# Altium schematic sheet PlacaTestingNov.SchDoc
size A4
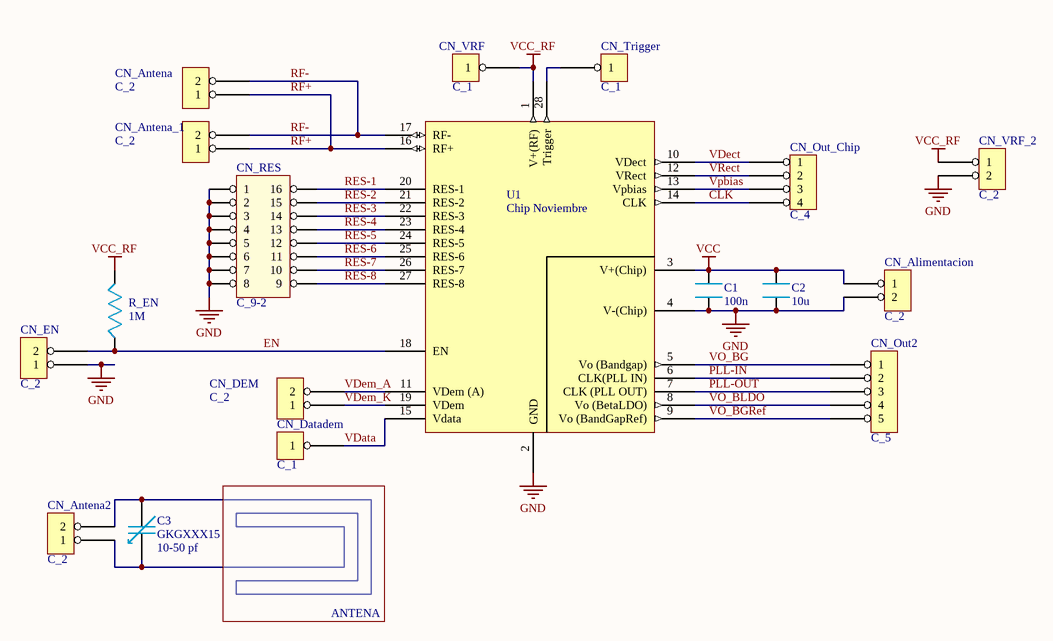
[diagram p0: PlacaTestingNov.SchDoc]

## Parts
C1  100n  [2x1 Pin Array]
C2  10u  [GKGXXX15]
C3  GKGXXX15  C: 10-50 pf  [GKGXXX15]
CN_Alimentacion  C_2  [2x1 Bornera]
CN_Antena  C_2  [2x1 Pin Array]
CN_Antena2  C_2  [2x1 Pin Array]
CN_Antena_1  C_2  [2x1 Bornera]
CN_Datadem  C_1  [1x1 Pin Array]
CN_DEM  C_2  [2x1 Pin Array]
CN_EN  C_2  [2x1 Pin Array]
CN_Out2  C_5  [5x1 Pin Array]
CN_Out_Chip  C_4  [4x1 Pin Array]
CN_RES  C_9-2  [PDIP_8]
CN_Trigger  C_1  [1x1 Pin Array]
CN_VRF  C_1  [1x1 Pin Array]
CN_VRF_2  C_2  [2x1 Bornera]
R_EN  1M  [R_1/4]
U1  Chip Noviembre  [PDIP_28 - Large]

## Nets
GND: C1.2 C2.2 CN_Alimentacion.2 CN_EN.1 CN_RES.1 CN_RES.2 CN_RES.3 CN_RES.4 CN_RES.5 CN_RES.6 CN_RES.7 CN_RES.8 CN_VRF_2.2 U1.2(GND) U1.4(V-(Chip))
VCC: C1.1 C2.1 CN_Alimentacion.1 U1.3(V+(Chip))
VCC_RF: CN_VRF.1 CN_VRF_2.1 R_EN.2 U1.1(V+(RF))
CLK: CN_Out_Chip.4 U1.14(CLK)
EN: CN_EN.2 R_EN.1 U1.18(EN)
PLL-IN: CN_Out2.2 U1.6(CLK(PLL_IN))
PLL-OUT: CN_Out2.3 U1.7(CLK_(PLL_OUT))
RES-1: CN_RES.16 U1.20(RES-1)
RES-2: CN_RES.15 U1.21(RES-2)
RES-3: CN_RES.14 U1.22(RES-3)
RES-4: CN_RES.13 U1.23(RES-4)
RES-5: CN_RES.12 U1.24(RES-5)
RES-6: CN_RES.11 U1.25(RES-6)
RES-7: CN_RES.10 U1.26(RES-7)
RES-8: CN_RES.9 U1.27(RES-8)
RF+: CN_Antena.1 CN_Antena_1.1 U1.16(RF+)
RF-: CN_Antena.2 CN_Antena_1.2 U1.17(RF-)
VData: CN_Datadem.1 U1.15(Vdata)
VDect: CN_Out_Chip.1 U1.10(VDect)
VDem_A: CN_DEM.2 U1.11(VDem_(A))
VDem_K: CN_DEM.1 U1.19(VDem)
VO_BG: CN_Out2.1 U1.5(Vo_(Bandgap))
VO_BGRef: CN_Out2.5 U1.9(Vo_(BandGapRef))
VO_BLDO: CN_Out2.4 U1.8(Vo_(BetaLDO))
Vpbias: CN_Out_Chip.3 U1.13(Vpbias)
VRect: CN_Out_Chip.2 U1.12(VRect)
NetC3_0: C3.0 C3.1 CN_Antena2.1 CN_Antena2.2
NetCN_Trigger_1: CN_Trigger.1 U1.28(Trigger)

## Notes on the sheet
- ANTENA

## Library data of the parts
C1 C2 = Cap: Capacitor
CN_Alimentacion CN_Antena CN_Antena2 CN_Antena_1 CN_DEM CN_EN CN_VRF_2 = C_2: Conector 2 pines
CN_Datadem CN_Trigger CN_VRF = C_1: Conector 1 pines
CN_Out2 = C_5: Conector 5 pines
CN_Out_Chip = C_4: Conector 4 pines
CN_RES = C_9-2: Connector 9 pins
R_EN = R: Chip Resistor
U1 = Chip Noviembre: UTN 500nm Nativo; Manufacturer: RFID Assembly; Manufacturer Part Number: Version 1.0omega